# Altium project 12_fit_switch.PrjPCB
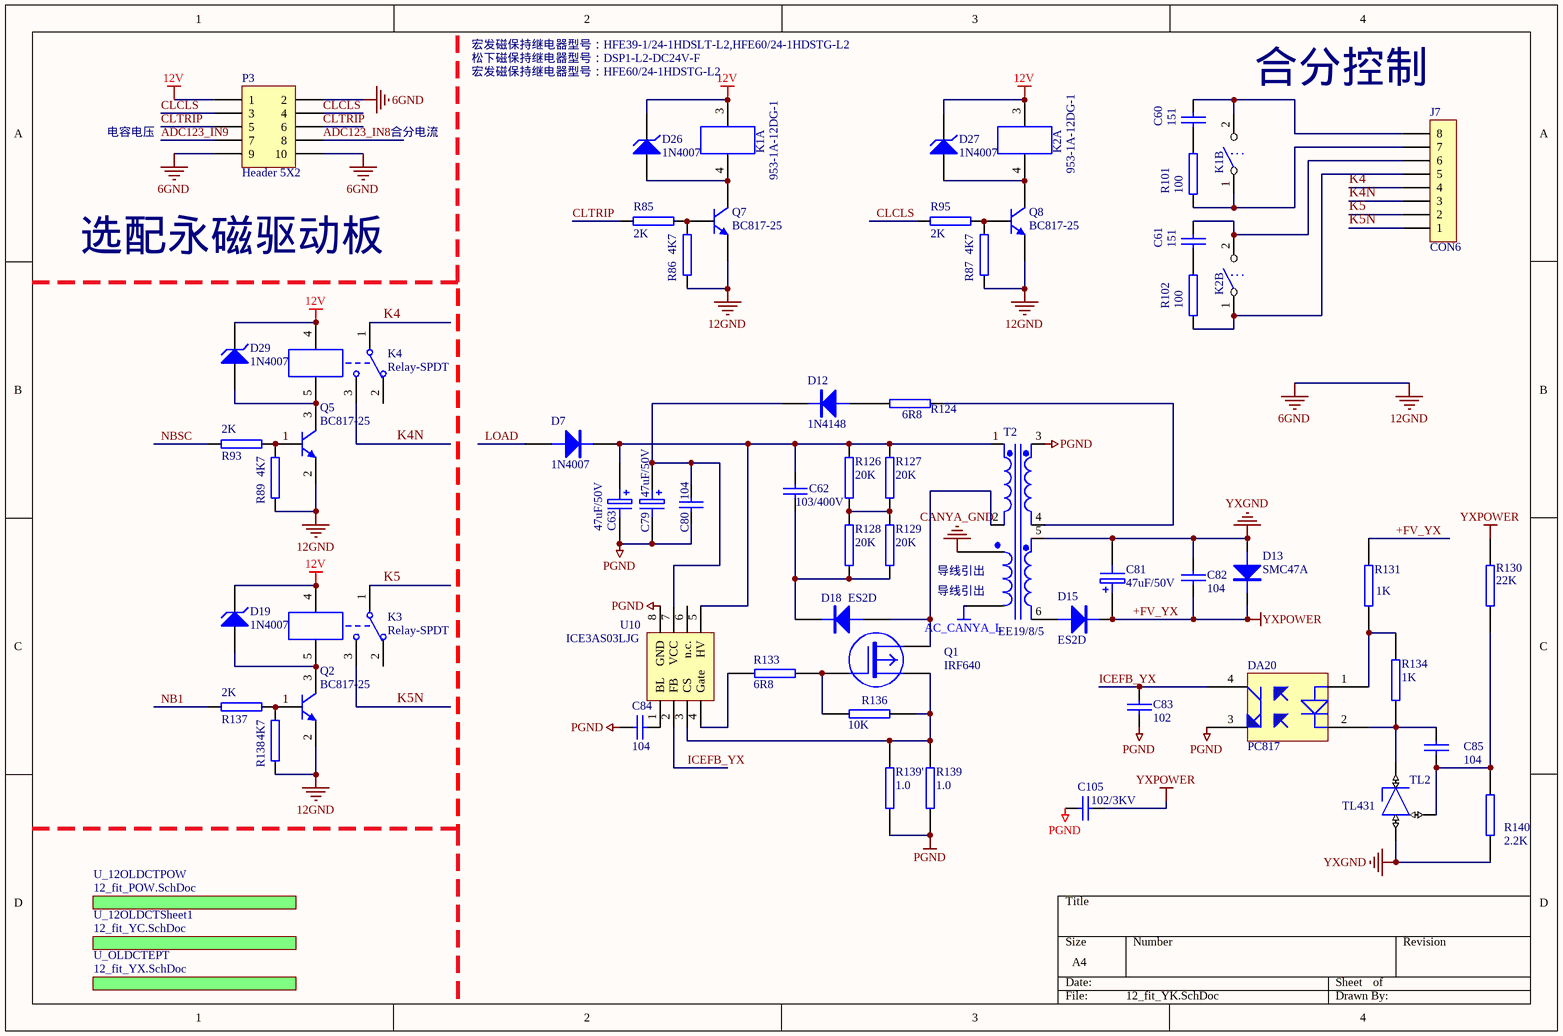
[diagram p0: 12_fit_YK.SchDoc]
4 sheets, 452 parts. Net scope: global (net labels, ports and power ports of the same name join across sheets).
Board file: 12_fit_switch.PcbDoc
Sheets:
  12_fit_YK.SchDoc
    U_12OLDCTPOW = 12_fit_POW.SchDoc
    U_12OLDCTSheet1 = 12_fit_YC.SchDoc
    U_OLDCTEPT = 12_fit_YX.SchDoc

## Sheet 12_fit_YK.SchDoc
size A4; SheetNumber: 3; SheetTotal: 3

### Parts
C60  151  [CAP_HV_10]
C61  151  [CAP_HV_10]
C62  103/400V  [CAP_HV_8]
C63  47uF/50V  [47u/50V]
C79  47uF/50V  [47u/50V]
C80  104  [C1206]
C81  47uF/50V  [47u/50V]
C82  104  [CBB104]
C83  102  [C1206]
C84  104  [C1206]
C85  104  [CBB104]
C105  102/3KV  [CAP_HV_8]
D7  1N4007  [DO-214AA]
D12  1N4148  [SMT_4148]
D13  SMC47A  [DO-214AB]
D15  ES2D  [DO-214AA]
D18  ES2D  [DO-214AA]
D19  1N4007  [DO-214AC]
D26  1N4007  [DO-214AC]
D27  1N4007  [DO-214AC]
D29  1N4007  [DO-214AC]
DA20  PC817  [dip4]
J7  CON6  [XR_POWER5.08_8_弯]
K1  953-1A-12DG-1  [953-1A-12DG-1]  (parts A,B of 2)
K2  953-1A-12DG-1  [953-1A-12DG-1]  (parts A,B of 2)
K3  Relay-SPDT  [JQX-115FA]
K4  Relay-SPDT  [JQX-115FA]
P3  Header 5X2  [HDR2X5]
Q1  IRF640  [TO220-IRF540]
Q2  BC817-25  [SOT-23]
Q5  BC817-25  [SOT-23]
Q7  BC817-25  [SOT-23]
Q8  BC817-25  [SOT-23]
R85  2K  [R1206]
R86  4K7  [R1206]
R87  4K7  [R1206]
R89  4K7  [R1206]
R93  2K  [R1206]
R95  2K  [R1206]
R101  100  [res-l5]
R102  100  [res-l5]
R124  6R8  [R1206]
R126  20K  [R1206]
R127  20K  [R1206]
R128  20K  [R1206]
R129  20K  [R1206]
R130  22K  [R1206]
R131  1K  [R1206]
R133  6R8  [R1206]
R134  1K  [R1206]
R136  10K  [R1206]
R137  2K  [R1206]
R138  4K7  [R1206]
R139  1.0  [R2512]
R139'  1.0  [R2512]
R140  2.2K  [R1206]
T2  EE19/8/5  [EE19/8/5]
TL2  TL431  [SOT-23]
U10  ICE3AS03LJG  [SO8]

### Sub-sheets
U_12OLDCTPOW = 12_fit_POW.SchDoc: no entries
U_12OLDCTSheet1 = 12_fit_YC.SchDoc: no entries
U_OLDCTEPT = 12_fit_YX.SchDoc: no entries

### Nets
12GND: P3.2 P3.9 P3.10 Q2.2(E) Q5.2(E) Q7.2(E) Q8.2(E) R86.1 R87.1 R89.1 R138.1  [also labelled 6GND]
12V: D19.2(K) D26.2(K) D27.2(K) D29.2(K) K1.3 K2.3 K3.4 K4.4 P3.1
+FV_YX: C81.1 C82.1 C105.2 D13.2(K) D15.2(K) R130.2 R131.2  [also labelled YXPOWER]
LOAD: D7.1(A)
PGND: C63.2 C79.2 C80.1 C83.1 C84.1 C105.1 DA20.3 R139.1 R139'.1 T2.3(Sec1+) U10.8(GND)
YXGND: C81.2 C82.2 D13.1(A) R140.1 T2.5(Sec2+) TL2.3(A)
ADC123_IN8: P3.8
ADC123_IN9: P3.7
CLCLS: P3.3 P3.4 R95.1
CLTRIP: P3.5 P3.6 R85.1
ICEFB_YX: C83.2 DA20.4 U10.2(FB)
K4: J7.4 K4.1
K4N: J7.3 K4.3
K5: J7.2 K3.1
K5N: J7.1 K3.3
NB1: R137.1
NBSC: R93.1
NetC60_1: C60.1 R101.1
NetC60_2: C60.2 J7.8 K1.2
NetC61_1: C61.1 J7.6 K2.2
NetC61_2: C61.2 R102.1
NetC62_1: C62.1 D18.2(K) R128.1 R129.1
NetC62_2: C62.2 C63.1 D7.2(K) R126.2 R127.2 T2.1(Pri+) U10.5(HV)
NetC79_1: C79.1 C80.2 D12.2(K) U10.7(VCC)
NetC84_2: C84.2 U10.1(BL)
NetC85_1: C85.1 DA20.2 R134.1 TL2.1(K)
NetC85_2: C85.2 R130.1 R140.2 TL2.2(R)
NetD12_1: D12.1(A) R124.1
NetD15_1: D15.1(A) T2.6(Sec2-)
NetD18_1: D18.1(A) Q1.2(D) T2.2(Pri-)
NetD19_1: D19.1(A) K3.5 Q2.3(C)
NetD26_1: D26.1(A) K1.4 Q7.3(C)
NetD27_1: D27.1(A) K2.4 Q8.3(C)
NetD29_1: D29.1(A) K4.5 Q5.3(C)
NetDA20_1: DA20.1 R131.1 R134.2
NetJ7_5: J7.5 K2.1 R102.2
NetJ7_7: J7.7 K1.1 R101.2
NetQ1_1: Q1.1(G) R133.1 R136.2
NetQ1_3: Q1.3(S) R136.1 R139.2 R139'.2 U10.3(CS)
NetQ2_1: Q2.1(B) R137.2 R138.2
NetQ5_1: Q5.1(B) R89.2 R93.2
NetQ7_1: Q7.1(B) R85.2 R86.2
NetQ8_1: Q8.1(B) R87.2 R95.2
NetR124_2: R124.2 T2.4(Sec1-)
NetR126_1: R126.1 R127.1 R128.2 R129.2
NetR133_2: R133.2 U10.4(Gate)

Not connected (* = marked no-connect by the designer): K3 2; K4 2; U10 6(n.c.)

### Notes on the sheet
- 宏发磁保持继电器型号：HFE39-1/24-1HDSLT-L2,HFE60/24-1HDSTG-L2
- 松下磁保持继电器型号：DSP1-L2-DC24V-F
- 宏发磁保持继电器型号：HFE60/24-1HDSTG-L2
- 合分控制
- 电容电压
- 合分电流
- 选配永磁驱动板
- 导线引出
- Labels drawn without touching a wire or pin: AC_CANYA_L, CANYA_GND

### Library data of the parts
C60-C62 C83 = CAP
C63 C79 C81 = ELECTRO1: Electrolytic Capacitor
C80 C82 C84 C85 C105 = CAP: Capacitor
D7 D12 D13 D15 D18 = DIODE
D19 D26 D27 D29 = D Zener: Zener Diode; Published: 8-Jun-2000; LatestRevisionDate: 17-Jul-2002; LatestRevisionNote: Re-released for DXP Platform.; PackageReference: DIODE-0.7; Publisher: Altium Limited; PackageDescription: Diode, Thru-Hole; 2 Leads; 0.7 in Pin Spacing
DA20 = TLP521-1
J7 = CON8: Connector
K1 K2 = RLY-STY1: RELAY
K3 K4 = Relay-SPDT: Single-Pole Dual-Throw Relay; Published: 24-Mar-1999; LatestRevisionDate: 17-Jul-2002; LatestRevisionNote: Re-released for DXP Platform.; PackageReference: MODULE5B; Publisher: Altium Limited
P3 = Header 5X2: Header, 5-Pin, Dual row; LatestRevisionDate: 17-Jul-2002; LatestRevisionNote: Re-released for DXP Platform.; Publisher: Altium Limited
Q1 = MOSFET-P1
Q2 Q5 Q7 Q8 = SOT-23 2SC3356-T1B-A    S/YS档: NPN; ComponentLink1Description: 供应商链接; ComponentLink1URL: http://www.szlcsc.com/product/details_10189.html; Package: SOT-23; Supplier: LC; SuppliersPartNumber: C9659
R85-R87 R89 R93 R95 R101 R102 R124 R126-R131 R133 R134 R136-R139 R139' R140 = RES2
T2 = Trans3 Ideal: Three-winding Transformer (Ideal); Published: 25-Jan-2001; LatestRevisionDate: 17-Jul-2002; LatestRevisionNote: Re-released for DXP Platform.; PackageReference: TRF_6; Publisher: Altium Limited; PackageDescription: Transformer; 6 Leads

## Sheet 12_fit_POW.SchDoc
size B; SheetNumber: 2; SheetTotal: 3
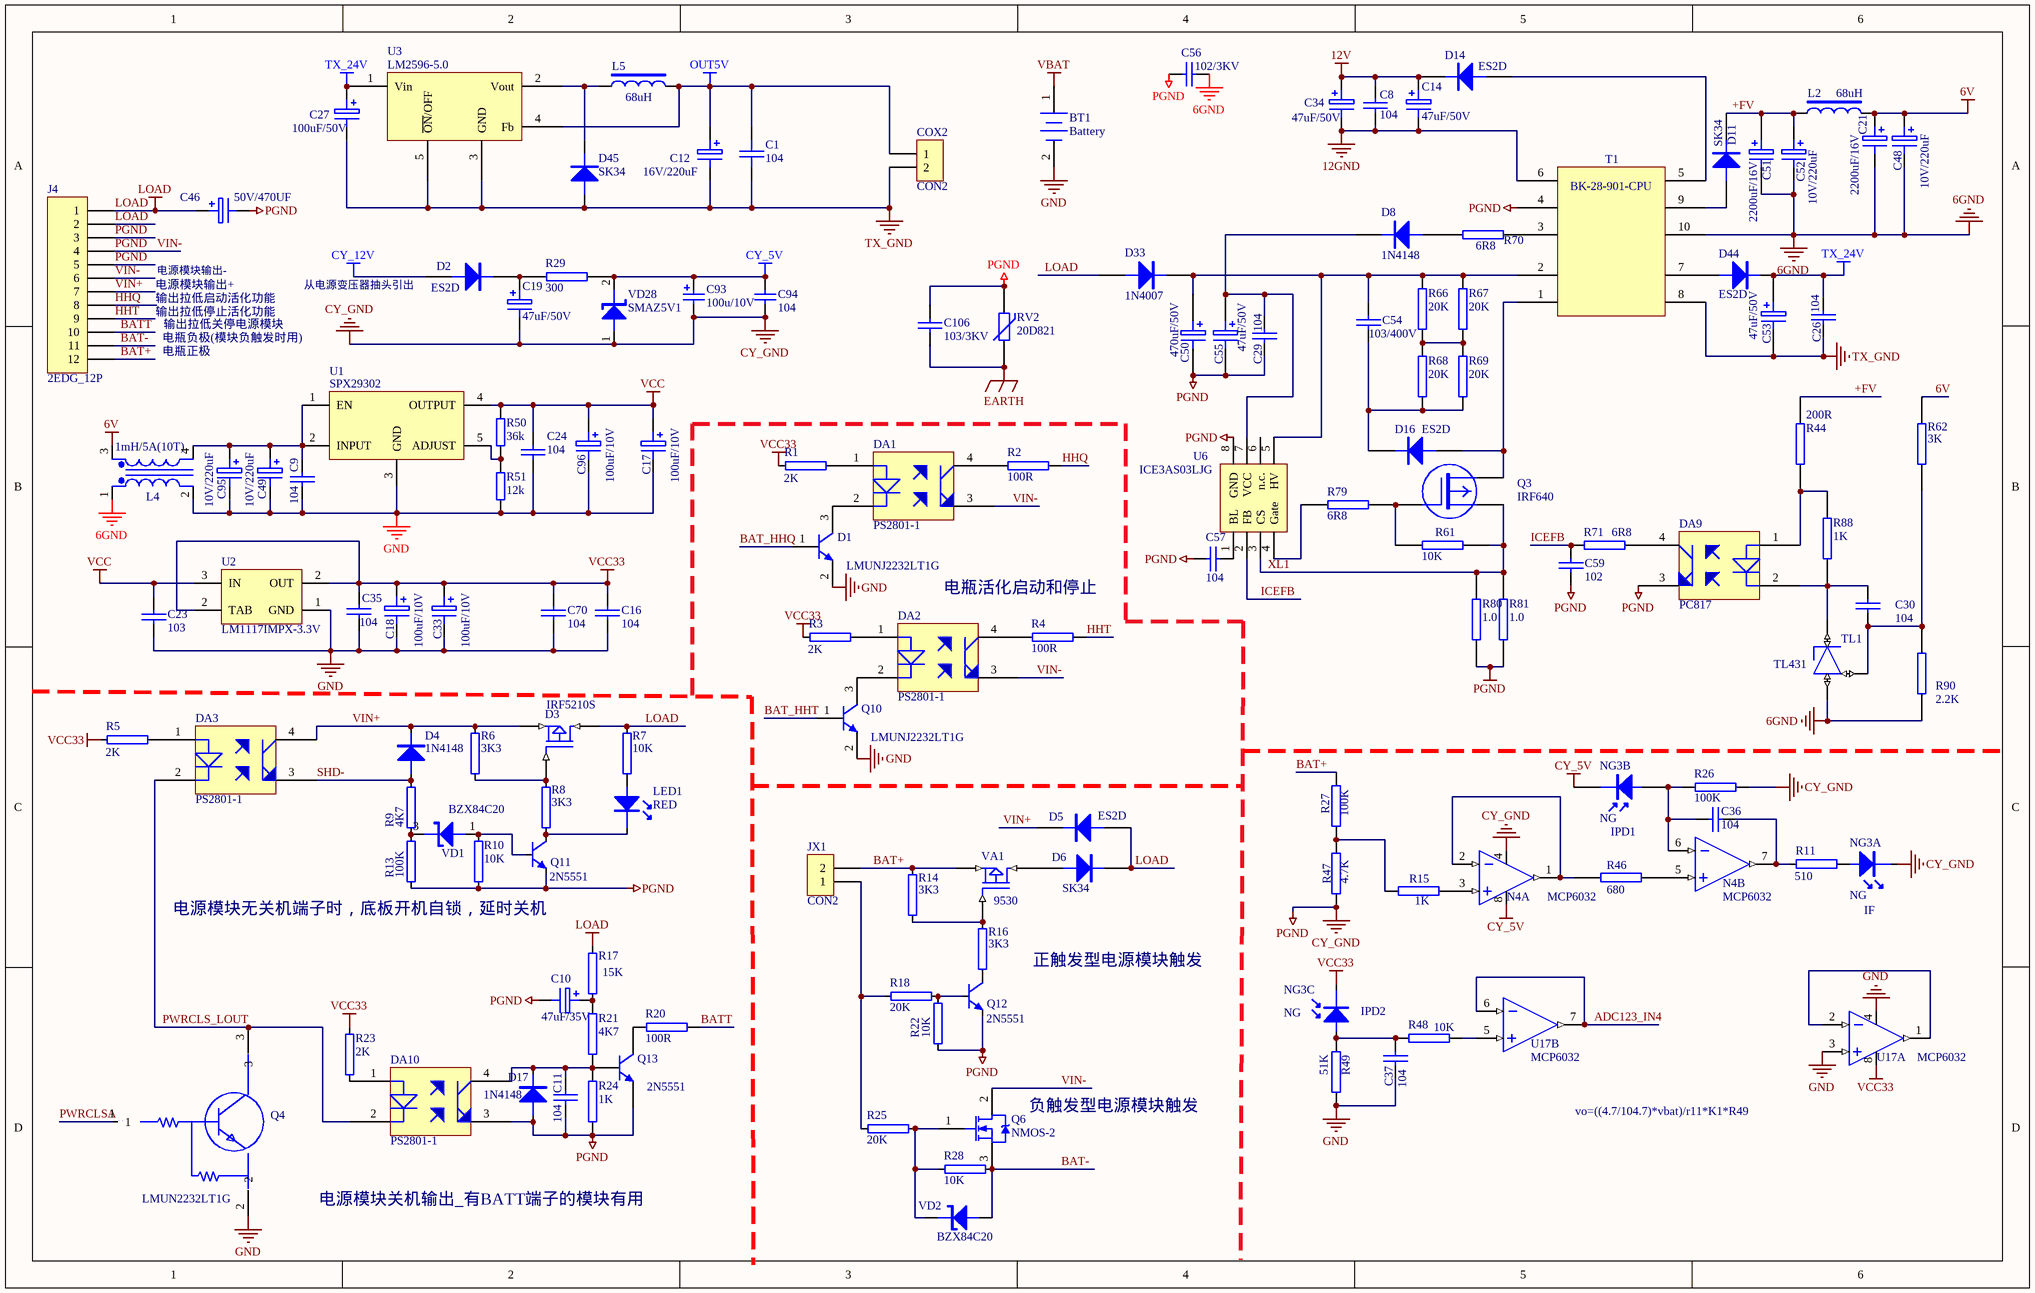
[diagram p1: 12_fit_POW.SchDoc]

### Parts
BT1  Battery  [3.3VBAT]
C1  104  [C1206]
C8  104  [CBB104]
C9  104  [CBB104]
C10  47uF/35V  [47u/50V]
C11  104  [C1206]
C12  16V/220uF  [钽电解C型EC6032]
C14  47uF/50V  [47u/50V]
C16  104  [C1206]
C17  100uF/10V  [钽电容B型3528]
C18  100uF/10V  [钽电容B型3528]
C19  47uF/50V  [47u/50V]
C21  2200uF/16V  [470u/63V]
C23  103  [C1206]
C24  104  [C1206]
C26  104  [C1206]
C27  100uF/50V  [SL-H贴片铝电解8mm]
C29  104  [C1206]
C30  104  [CBB104]
C33  100uF/10V  [钽电容B型3528]
C34  47uF/50V  [47u/50V]
C35  104  [C1206]
C36  104  [C1206]
C37  104  [C1206]
C46  50V/470UF  [470u/63V]
C48  10V/220uF  [钽电解C型EC6032]
C49  10V/220uF  [钽电解C型EC6032]
C50  470uF/50V  [470u/63V]
C51  2200uF/16V  [470u/63V]
C52  10V/220uF  [钽电解C型EC6032]
C53  47uF/50V  [47u/50V]
C54  103/400V  [CAP_HV_8]
C55  47uF/50V  [47u/50V]
C56  102/3KV  [CAP_HV_8]
C57  104  [C1206]
C59  102  [C1206]
C70  104  [C1206]
C93  100u/10V  [钽电容B型3528]
C94  104  [C1206]
C95  10V/220uF  [钽电解C型EC6032]
C96  100uF/10V  [钽电容B型3528]
C106  103/3KV  [CAP_HV_8]
COX2  CON2  [5569_2P_4.2直]
D1  LMUNJ2232LT1G  [SOT-23]
D2  ES2D  [DO-214AA]
D3  IRF5210S  [TO-220-SRQ]
D4  1N4148  [SMT_4148]
D5  ES2D  [DO-214AA]
D6  SK34  [DO-214AA]
D8  1N4148  [SMT_4148]
D11  SK34  [DO-214AA]
D14  ES2D  [DO-214AA]
D16  ES2D  [DO-214AA]
D17  1N4148  [SMT_4148]
D33  1N4007  [DO-214AA]
D44  ES2D  [DO-214AA]
D45  SK34  [DO-214AA]
DA1  PS2801-1  [SO-4]
DA2  PS2801-1  [SO-4]
DA3  PS2801-1  [SO-4]
DA9  PC817  [dip4]
DA10  PS2801-1  [SO-4]
J4  2EDG_12P  [XR_POWER5.08_12_弯]
JX1  CON2  [5569_2P_4.2直]
L2  68uH  [L680-TP]
L4  1mH/5A(10T)  [EMI_22_3mH]
L5  68uH  [L680-TP]
LED1  RED  [LED1206]
N4  MCP6032  [SO8]  (parts A,B of 2)
NG3  NG  [DIP8W]  (parts A,B,C of 3)
Q3  IRF640  [TO220-IRF540]
Q4  LMUN2232LT1G  [SOT-23]
Q6  NMOS-2  [TO220-IRF540]
Q10  LMUNJ2232LT1G  [SOT-23]
Q11  2N5551  [SOT-23]
Q12  2N5551  [SOT-23]
Q13  2N5551  [SOT-23]
R1  2K  [R1206]
R2  100R  [R1206]
R3  2K  [R1206]
R4  100R  [R1206]
R5  2K  [R1206]
R6  3K3  [R1206]
R7  10K  [R1206]
R8  3K3  [R1206]
R9  4K7  [R1206]
R10  10K  [R1206]
R11  510  [R1206]
R13  100K  [R1206]
R14  3K3  [R1206]
R15  1K  [R1206]
R16  3K3  [R1206]
R17  15K  [R1206]
R18  20K  [R1206]
R20  100R  [R1206]
R21  4K7  [R1206]
R22  10K  [R1206]
R23  2K  [R1206]
R24  1K  [R1206]
R25  20K  [R1206]
R26  100K  [R1206]
R27  100K  [R1206]
R28  10K  [R1206]
R29  300  [R2512]
R44  200R  [R1206]
R46  680  [R1206]
R47  4.7K  [R1206]
R48  10K  [R1206]
R49  51K  [R1206]
R50  36k  [R1206]
R51  12k  [R1206]
R61  10K  [R1206]
R62  3K  [R1206]
R66  20K  [R1206]
R67  20K  [R1206]
R68  20K  [R1206]
R69  20K  [R1206]
R70  6R8  [R1206]
R71  6R8  [R1206]
R79  6R8  [R1206]
R80  1.0  [R2512]
R81  1.0  [R2512]
R88  1K  [R1206]
R90  2.2K  [R1206]
RV2  20D821  [20D301]
T1  BK-28-901-CPU  [DC24S15]
TL1  TL431  [SOT-23]
U1  SPX29302  [TO-263-5]
U2  LM1117IMPX-3.3V  [SOT223]
U3  LM2596-5.0  [TO-263-5]
U6  ICE3AS03LJG  [SO8]
U17  MCP6032  [SO8]  (parts A,B of 2)
VA1  9530  [TO220-IRF540]
VD1  BZX84C20  [SOT-23]
VD2  BZX84C20  [SOT-23]
VD28  SMAZ5V1  [DO-214AC]

### Nets
6V: C21.1 C48.1 L2.2 L4.3(Sec+) R62.2
12GND: C8.2 C14.2 C21.2 C34.2 C48.2 C51.2 C52.2 C56.2 L4.1(Pri+) R90.1 T1.6 T1.10 TL1.3(A)  [also labelled 6GND]
12V: C8.1 C14.1 C34.1 D14.2(K)
CY_5V: C93.1 C94.2 N4.8 NG3.3(K) R29.1 VD28.2
CY_12V: D2.1(A)
EARTH: C106.1 RV2.1
GND: BT1.2(-) C9.2 C16.1 C17.2 C18.2 C23.2 C24.1 C33.2 C35.2 C37.2 C49.2 C70.1 C95.2 C96.2 D1.2(E) L4.2(Pri-) Q4.2 Q10.2(E) R49.1 R51.1 U1.3(GND) U2.1(GND) U17.3 U17.4
LOAD: C46.1 D3.2(D) D5.1(A) D6.2(K) D33.1(A) J4.1 J4.2 R7.2 R17.2
OUT5V: C1.2 C12.1 COX2.1 L5.2 U3.4(Fb)
PGND: C10.2 C11.1 C19.2 C29.1 C46.2 C50.2 C55.2 C56.1 C57.1 C59.1 C93.2 C94.1 C106.2 D17.1(A) DA1.3 DA2.3 DA9.3 DA10.3 J4.3 J4.4 J4.5 J4.6 N4.4 NG3.1(K) Q6.2(D) Q11.2(E) Q12.2(E) Q13.2(E) R10.2 R13.2 R22.1 R24.1 R26.1 R47.1 R80.1 R81.1 RV2.2 T1.4 U6.8(GND) VD28.1  [also labelled CY_GND, VIN-]
TX_24V: C26.1 C27.1 C53.1 D44.2(K) U3.1(Vin)
TX_GND: C1.1 C12.2 C26.2 C27.2 C53.2 COX2.2 D45.1 T1.8 U3.3(GND) U3.5(~{ON}/OFF)
VBAT: BT1.1(+)
VCC: C17.1 C23.1 C24.2 C96.1 R50.1 U1.4(OUTPUT) U2.3(IN)
VCC33: C16.2 C18.1 C33.1 C35.1 C70.2 NG3.6(K) R1.2 R3.2 R5.2 R23.1 U2.2(OUT) U17.8
+FV: C51.1 C52.1 D11.2(K) L2.1 R44.2
ADC123_IN4: U17.6 U17.7
BAT+: J4.12 JX1.2 R14.2 R27.2 VA1.3(S)
BAT-: J4.11 Q6.3(S) R28.1 VD2.1
BAT_HHQ: D1.1(B)
BAT_HHT: Q10.1(B)  [project net ADC123_IN3]
BATT: J4.10 R20.1
HHQ: J4.8 R2.1
HHT: J4.9 R4.1
ICEFB: C59.2 R71.1 U6.2(FB)
PWRCLS_LOUT: DA3.2 DA10.2 Q4.3
PWRCLSA: Q4.1
SHD-: D4.1(A) DA3.3 R9.2
VIN+: D3.3(S) D4.2(K) D5.2(K) DA3.4 J4.7 R6.2
XL1: Q3.3(S) R61.1 R80.2 R81.2 U6.3(CS)
NetC9_1: C9.1 C49.1 C95.1 L4.4(Sec-) U1.1(EN) U1.2(INPUT)
NetC10_1: C10.1 R17.1 R21.2
NetC11_2: C11.2 D17.2(K) DA10.4 Q13.1(B) R21.1 R24.2
NetC19_1: C19.1 D2.2(K) R29.2
NetC29_2: C29.2 C55.1 D8.2(K) U6.7(VCC)
NetC30_1: C30.1 DA9.2 R88.1 TL1.1(K)
NetC30_2: C30.2 R62.1 R90.2 TL1.2(R)
NetC36_1: C36.1 N4.6 NG3.4(A) R26.2
NetC36_2: C36.2 N4.7 R11.2
NetC37_1: C37.1 NG3.5(A) R48.2 R49.2
NetC50_1: C50.1 C54.2 D33.2(K) R66.2 R67.2 T1.2 U6.5(HV)
NetC54_1: C54.1 D16.2(K) R68.1 R69.1
NetC57_2: C57.2 U6.1(BL)
NetD1_3: D1.3(C) DA1.2
NetD3_1: D3.1(G) R6.1 R8.2
NetD6_1: D6.1(A) VA1.2(D)
NetD8_1: D8.1(A) R70.1
NetD11_1: D11.1(A) T1.9
NetD14_1: D14.1(A) T1.5
NetD16_1: D16.1(A) Q3.2(D) T1.1
NetD44_1: D44.1(A) T1.7
NetD45_2: D45.2 L5.1 U3.2(Vout)
NetDA1_1: DA1.1 R1.1
NetDA1_4: DA1.4 R2.2
NetDA2_1: DA2.1 R3.1
NetDA2_2: DA2.2 Q10.3(C)
NetDA2_4: DA2.4 R4.2
NetDA3_1: DA3.1 R5.1
NetDA9_1: DA9.1 R44.1 R88.2
NetDA9_4: DA9.4 R71.2
NetDA10_1: DA10.1 R23.2
NetJX1_1: JX1.1 R18.2 R25.2
NetLED1_A: LED1.A R7.1
NetLED1_K: LED1.K Q11.3(C) R8.1
NetN4_1: N4.1 N4.2 R46.1
NetN4_3: N4.3 R15.1
NetN4_5: N4.5 R46.2
NetNG3_2: NG3.2(A) R11.1
NetQ3_1: Q3.1(G) R61.2 R79.1
NetQ6_1: Q6.1(G) R25.1 R28.2 VD2.3
NetQ11_1: Q11.1(B) R10.1 VD1.1
NetQ12_1: Q12.1(B) R18.1 R22.2
NetQ12_3: Q12.3(C) R16.1
NetQ13_3: Q13.3(C) R20.2
NetR9_1: R9.1 R13.1 VD1.3
NetR14_1: R14.1 R16.2 VA1.1(G)
NetR15_2: R15.2 R27.1 R47.2
NetR48_1: R48.1 U17.5
NetR50_2: R50.2 R51.2 U1.5(ADJUST)
NetR66_1: R66.1 R67.1 R68.2 R69.2
NetR70_2: R70.2 T1.3
NetR79_2: R79.2 U6.4(Gate)
NetU17_1: U17.1 U17.2

Not connected (* = marked no-connect by the designer): U6 6(n.c.)

### Notes on the sheet
- 电源模块输出+
- 输出拉低启动活化功能
- 电源模块输出-
- 从电源变压器抽头引出
- 输出拉低停止活化功能
- 电瓶正极
- 电瓶负极(模块负触发时用)
- 输出拉低关停电源模块
- 电瓶活化启动和停止
- IPD1
- 电源模块无关机端子时，底板开机自锁，延时关机
- 正触发型电源模块触发
- IF
- IPD2
- (near Q6) 负触发型电源模块触发
- vo=((4.7/104.7)*vbat)/r11*K1*R49
- 电源模块关机输出_有BATT端子的模块有用

### Library data of the parts
BT1 = Battery: Multicell Battery; Published: 24-Mar-1999; LatestRevisionDate: 17-Jul-2002; LatestRevisionNote: Re-released for DXP Platform.; PackageReference: BAT-2; Publisher: Altium Limited; PackageDescription: Battery; 2 Leads
C1 C8 C9 C11 C16 C23 C24 C26 C29 C30 C36 C37 C56 C57 C70 C106 = CAP: Capacitor
C10 C14 C19 C34 C46 C50 C51 C53 C55 = ELECTRO1: Electrolytic Capacitor
C12 C48 C49 C52 C95 = ELECTRO: Electrolytic Capacitor
C17 C18 C21 C27 C33 C96 = ELECTRO1
C35 C54 C59 = CAP
C93 = Cap Pol2: Polarized Capacitor (Axial); Value: 100pF; Published: 8-Jun-2000; LatestRevisionDate: 17-Jul-2002; LatestRevisionNote: Re-released for DXP Platform.; PackageReference: POLAR0.8; Publisher: Altium Limited; PackageDescription: Polarized Capacitor; 2 Leads
C94 = Cap: Capacitor; Value: 100pF; Published: 8-Jun-2000; LatestRevisionDate: 17-Jul-2002; LatestRevisionNote: Re-released for DXP Platform.; PackageReference: RAD-0.3; Publisher: Altium Limited; PackageDescription: Radial Cap, Thru-Hole; 2 Leads; 0.3 in Pin Spacing
COX2 JX1 = CON2: Connector
D1 Q10-Q13 = SOT-23 2SC3356-T1B-A    S/YS档: 三极管; ComponentLink1Description: 供应商链接; ComponentLink1URL: http://www.szlcsc.com/product/details_10189.html; Package: SOT-23; Supplier: LC; SuppliersPartNumber: C9659
D2 D4-D6 D8 D11 D14 D16 D17 D33 D44 = DIODE
D3 VA1 = MOSFET P
D45 = DIDOE: Diode
DA1-DA3 DA9 DA10 = TLP521-1
J4 = Header 12: Header, 12-Pin; LatestRevisionDate: 17-Jul-2002; LatestRevisionNote: Re-released for DXP Platform.; Publisher: Altium Limited
L2 L5 = INDUCTOR2
L4 = Trans Cupl: Transformer (Coupled Inductor Model); Published: 8-Jun-2000; LatestRevisionDate: 17-Jul-2002; LatestRevisionNote: Re-released for DXP Platform.; PackageReference: TRF_4; Publisher: Altium Limited; PackageDescription: Transformer; 4 Leads
LED1 = LED
N4 U17 = TL082
Q3 = MOSFET-P1
Q4 = T-NPN-LMUN2232LT1G-SOT23: Vceo=50V,Vcbo=50V,Ic=100mA,Hfe=15@Ic=5mA,R1=R2=4.7k; MFR: ROHM; Geometry.Height: 1.2mm; SN: 41100010; TYPE: NPN数字三极管; Value: DNI-LMUN2232LT1G; PCB DECAL: SOT23; MPN: LMUN2232LT1G; PCB Footprint: SOT-23
Q6 = NMOS-2: N-Channel Power MOSFET; Note: Pin 2 is electrically connected to pin 4.; Published: 8-Jun-2000; LatestRevisionDate: 17-Jul-2002; LatestRevisionNote: Re-released for DXP Platform.; DatasheetVersion: PD-9.814; PackageVersion: Feb-1997; PackageReference: TO-220AB; Publisher: Altium Limited; PackageDescription: TO, Thru-Hole, Vertical, Heatsink Mounted; 3 In-Line Leads; Pitch 2.54 mm; ComponentLink1Description: Manufacturer Link; ComponentLink1URL: http://www.irf.com/
R1-R11 R13-R18 R20-R29 R44 R46-R49 R61 R62 R66-R71 R79-R81 R88 R90 = RES2
R50 R51 = RES
RV2 = VARISTOR
T1 = DC24S15
U2 = LM1117IMPX-3.3: 800mA Low-Dropout Linear Regulator, 4-pin SOT-223; Manufacturer: National Semiconductor; PackageTopMarking: XYTT*N05B; PowerWise: N; CompType: LDO IC; Published: 1-Mar-2010; DatasheetVersion: Apr-2006; PackageVersion: revB, Apr-2003; PackageReference: MP04A; Publisher: Altium Limited; PackageDescription: Molded SOT-223, 6.50 x 3.56 x 1.6mm Body, 4 Lead, 2.3mm Pitch; PartNumber: LM1117IMPX-3.3; RoHS: N; PinCount: 4; Code_JEDEC: TO-261-AA; Code_IPC: SOT223-4; ComponentLink1Description: LM1117 Datasheet; ComponentLink1URL: http://www.national.com/ds/LM/LM1117.pdf; ComponentLink2Description: LM1117 Web Page; ComponentLink2URL: http://www.national.com/pf/LM/LM1117.html; ComponentLink3Description: MP04A Package Page; ComponentLink3URL: http://www.national.com/packaging/folders/mp04a.html
U3 = LM2596
VD1 VD2 VD28 = ZENER2

## Sheet 12_fit_YC.SchDoc
size A2
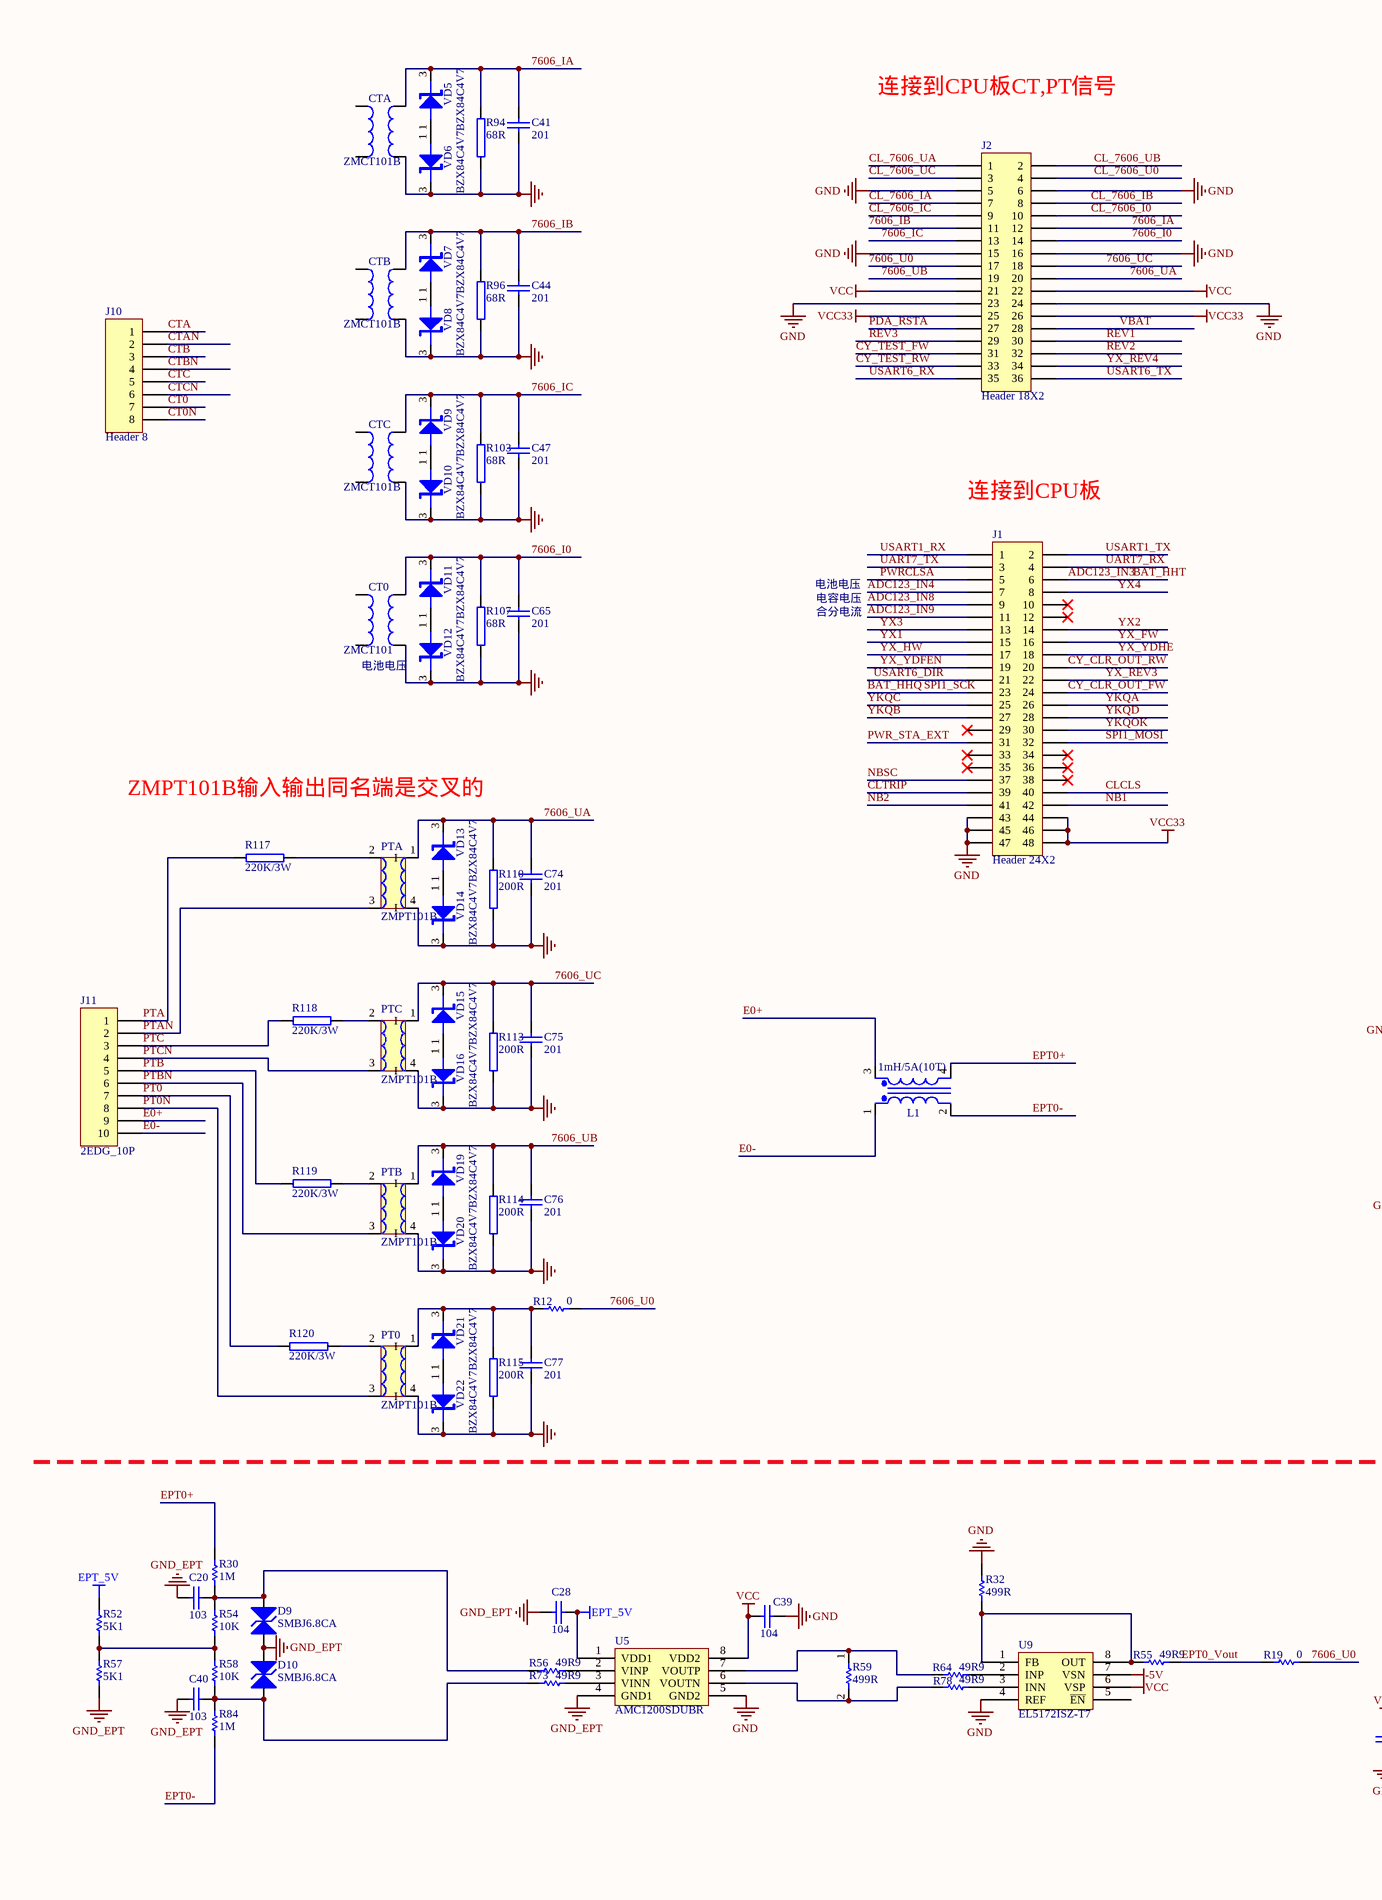
[diagram p2: 12_fit_YC.SchDoc, left]
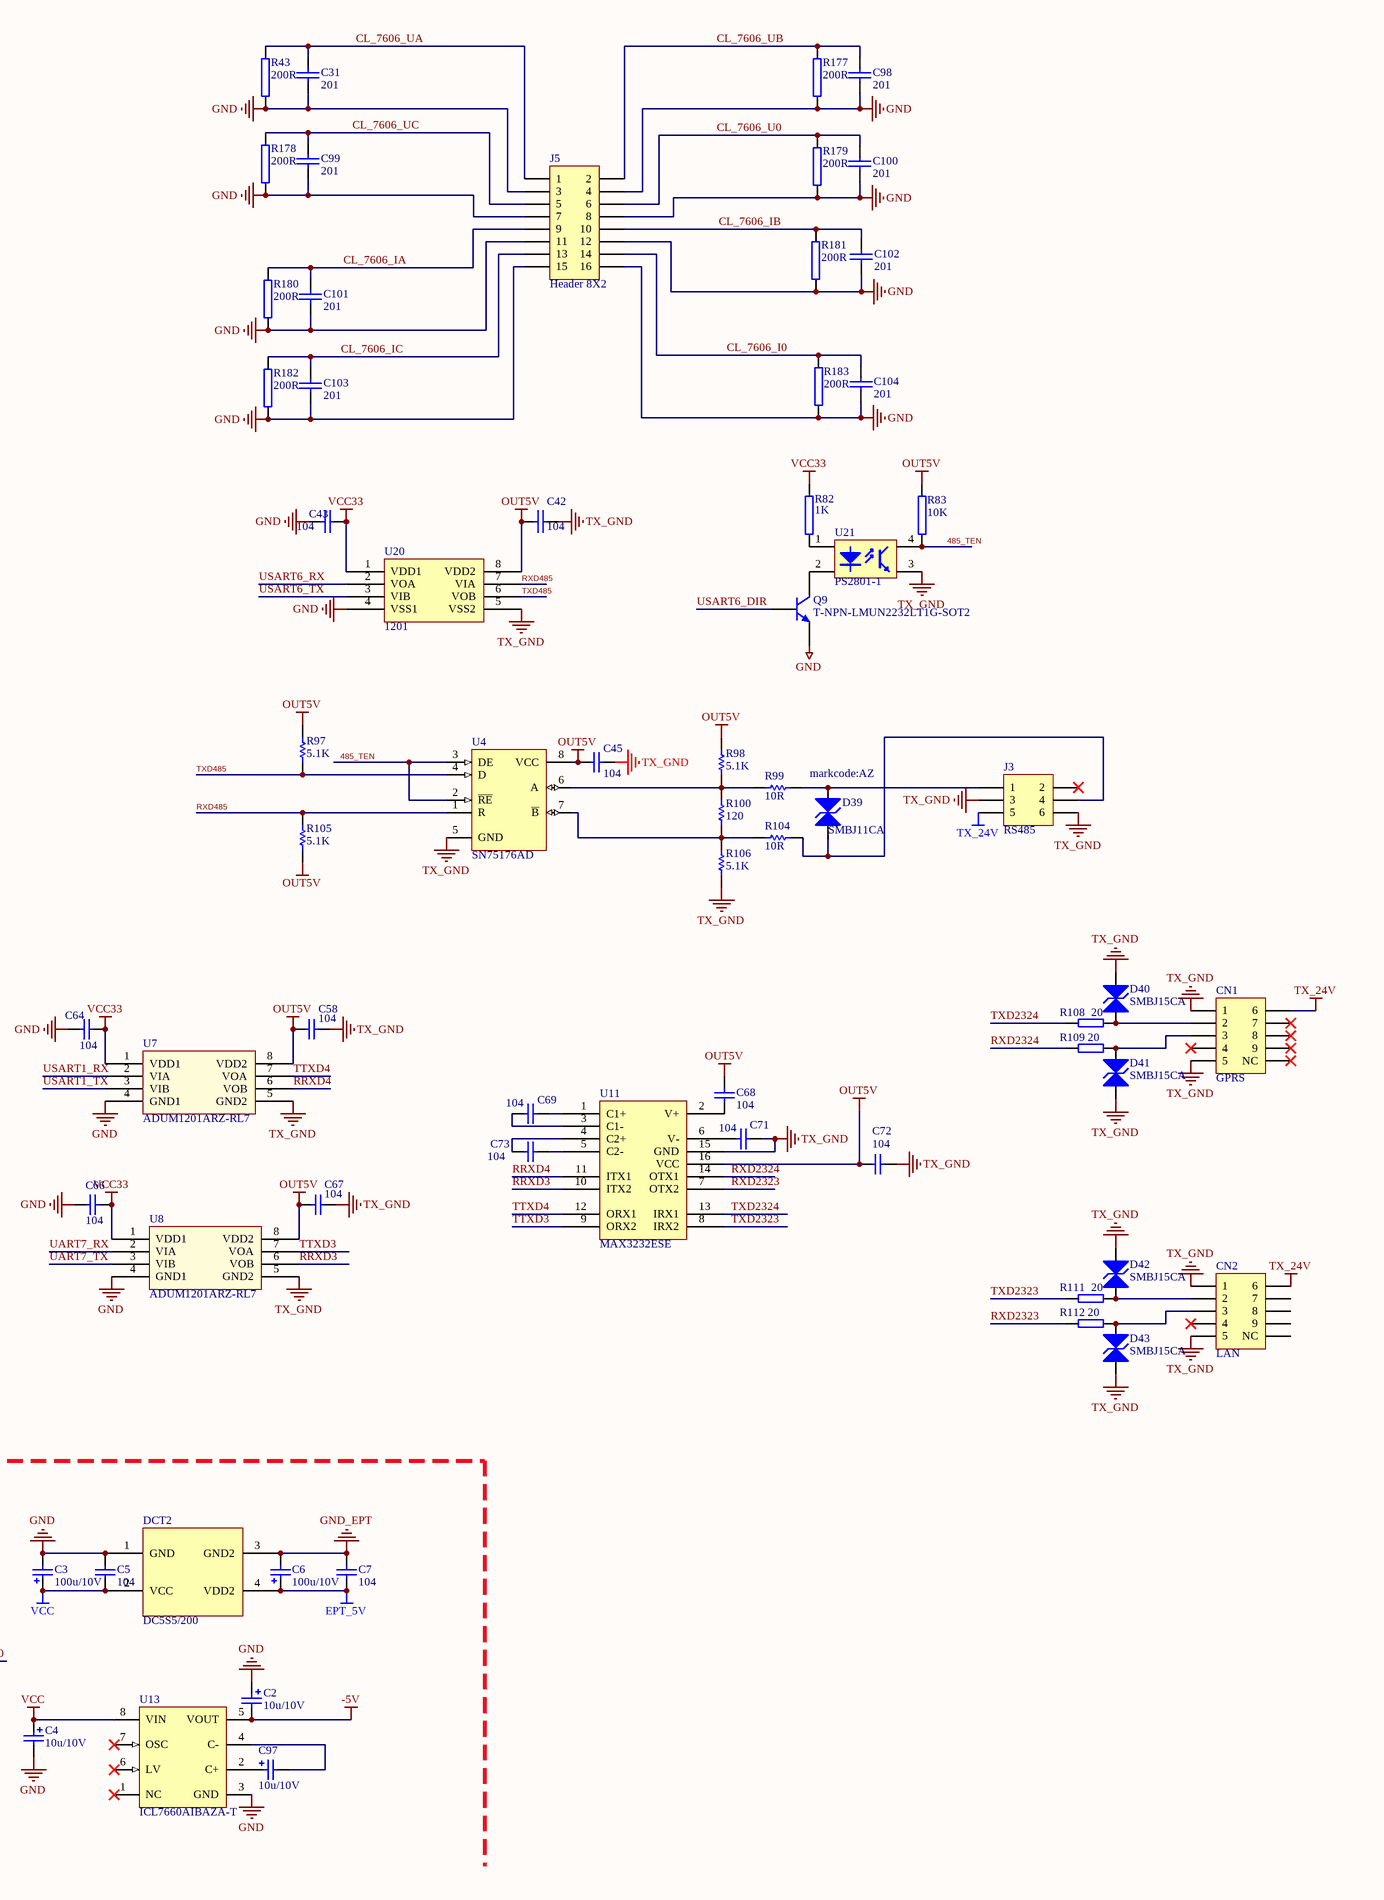
[diagram p3: 12_fit_YC.SchDoc, right]

### Parts
C2  10u/10V  [钽电容B型3528]
C3  100u/10V  [钽电容B型3528]
C4  10u/10V  [钽电容B型3528]
C5  104  [C1206]
C6  100u/10V  [钽电容B型3528]
C7  104  [C1206]
C20  103  [C1206]
C28  104  [C1206]
C31  201  [C1206]
C39  104  [C1206]
C40  103  [C1206]
C41  201  [C1206]
C42  104  [C1206]
C43  104  [C1206]
C44  201  [C1206]
C45  104  [C1206]
C47  201  [C1206]
C58  104  [C1206]
C64  104  [C1206]
C65  201  [C1206]
C66  104  [C1206]
C67  104  [C1206]
C68  104  [C1206]
C69  104  [C1206]
C71  104  [C1206]
C72  104  [C1206]
C73  104  [C1206]
C74  201  [C1206]
C75  201  [C1206]
C76  201  [C1206]
C77  201  [C1206]
C97  10u/10V  [钽电容B型3528]
C98  201  [C1206]
C99  201  [C1206]
C100  201  [C1206]
C101  201  [C1206]
C102  201  [C1206]
C103  201  [C1206]
C104  201  [C1206]
CN1  GPRS  [IDC10]
CN2  LAN  [IDC10]
CT0  ZMCT101  [ZMCT101B_OUTLINE]
CTA  ZMCT101B  [ZMCT101B_OUTLINE]
CTB  ZMCT101B  [ZMCT101B_OUTLINE]
CTC  ZMCT101B  [ZMCT101B_OUTLINE]
D9  SMBJ6.8CA  [SMT-5822]
D10  SMBJ6.8CA  [SMT-5822]
D39  SMBJ11CA  [SMT-5822]
D40  SMBJ15CA  [SMT-5822]
D41  SMBJ15CA  [SMT-5822]
D42  SMBJ15CA  [SMT-5822]
D43  SMBJ15CA  [SMT-5822]
DCT2  DC5S5/200  [IB-LS]
J1  Header 24X2  [HDR2X24]
J2  Header 18X2  [HDR2X18]
J3  RS485  [5569_3X2_4.2直]
J5  Header 8X2  [双排针母座2.54_2*8]
J10  Header 8  [XR_POWER9.5_8]
J11  2EDG_10P  [XR_POWER5.08_10_弯]
L1  1mH/5A(10T)  [EMI_22_3mH]
PT0  ZMPT101B  [ZMPT107]
PTA  ZMPT101B  [PT_SPT204A_2/2mA]
PTB  ZMPT101B  [ZMPT107]
PTC  ZMPT101B  [PT_SPT204A_2/2mA]
Q9  T-NPN-LMUN2232LT1G-SOT2  [SOT-23]
R12  0  [R1206]
R19  0  [R1206]
R30  1M  [R1206]
R32  499R  [R1206]
R43  200R  [R1206]
R52  5K1  [R1206]
R54  10K  [R1206]
R55  49R9  [R1206]
R56  49R9  [R1206]
R57  5K1  [R1206]
R58  10K  [R1206]
R59  499R  [R1206]
R64  49R9  [R1206]
R73  49R9  [R1206]
R78  49R9  [R1206]
R82  1K  [R1206]
R83  10K  [R1206]
R84  1M  [R1206]
R94  68R  [R1206]
R96  68R  [R1206]
R97  5.1K  [R1206]
R98  5.1K  [R1206]
R99  10R  [R1206]
R100  120  [R1206]
R103  68R  [R1206]
R104  10R  [R1206]
R105  5.1K  [R1206]
R106  5.1K  [R1206]
R107  68R  [R1206]
R108  20  [R1206]
R109  20  [R1206]
R110  200R  [R1206]
R111  20  [R1206]
R112  20  [R1206]
R113  200R  [R1206]
R114  200R  [R1206]
R115  200R  [R1206]
R117  220K/3W  [res-l5]
R118  220K/3W  [res-l5]
R119  220K/3W  [res-l5]
R120  220K/3W  [res-l5]
R177  200R  [R1206]
R178  200R  [R1206]
R179  200R  [R1206]
R180  200R  [R1206]
R181  200R  [R1206]
R182  200R  [R1206]
R183  200R  [R1206]
U4  SN75176AD  [SO8]
U5  AMC1200SDUBR  [SOP8(贴片DIP8)]
U7  ADUM1201ARZ-RL7  [SO8]
U8  ADUM1201ARZ-RL7  [SO8]
U9  EL5172ISZ-T7  [SO8]
U11  MAX3232ESE  [SOP16]
U13  ICL7660AIBAZA-T  [SO8]
U20  1201  [SO8]
U21  PS2801-1  [SO-4]
VD5  BZX84C4V7  [SOT-23]
VD6  BZX84C4V7  [SOT-23]
VD7  BZX84C4V7  [SOT-23]
VD8  BZX84C4V7  [SOT-23]
VD9  BZX84C4V7  [SOT-23]
VD10  BZX84C4V7  [SOT-23]
VD11  BZX84C4V7  [SOT-23]
VD12  BZX84C4V7  [SOT-23]
VD13  BZX84C4V7  [SOT-23]
VD14  BZX84C4V7  [SOT-23]
VD15  BZX84C4V7  [SOT-23]
VD16  BZX84C4V7  [SOT-23]
VD19  BZX84C4V7  [SOT-23]
VD20  BZX84C4V7  [SOT-23]
VD21  BZX84C4V7  [SOT-23]
VD22  BZX84C4V7  [SOT-23]

### Nets
-5V: C2.2 U9.7(VSN) U13.5(VOUT)
EPT_5V: C6.1 C7.2 C28.1 DCT2.4(VDD2) R52.1 U5.1(VDD1)
GND: C2.1 C3.2 C4.2 C5.1 C31.2 C39.1 C41.2 C43.1 C44.2 C47.2 C64.1 C65.2 C66.1 C74.2 C75.2 C76.2 C77.2 C98.2 C99.2 C100.2 C101.2 C102.2 C103.2 C104.2 CT0.2 CTA.2 CTB.2 CTC.2 DCT2.1(GND) J1.43 J1.45 J1.47 J2.5 J2.6 J2.15 J2.16 J2.23 J2.24 J5.3 J5.4 J5.7 J5.8 J5.11 J5.12 J5.15 J5.16 PT0.4(I) PTA.4(I) PTB.4(I) PTC.4(I) Q9.2(E) R32.1 R43.1 R94.1 R96.1 R103.1 R107.1 R110.1 R113.1 R114.1 R115.1 R177.1 R178.1 R179.1 R180.1 R181.1 R182.1 R183.1 U5.5(GND2) U7.4(GND1) U8.4(GND1) U9.4(REF) U13.3(GND) U20.4(VSS1) VD6.3(K) VD8.3(K) VD10.3(K) VD12.3(K) VD14.3(K) VD16.3(K) VD20.3(K) VD22.3(K)
GND_EPT: C6.2 C7.1 C20.2 C28.2 C40.2 D9.1(A) D10.1(A) DCT2.3(GND2) R57.2 U5.4(GND1)
OUT5V: C42.2 C45.2 C58.2 C67.2 C68.1 C72.2 R83.2 R97.1 R98.2 R105.1 U4.8(VCC) U7.8(VDD2) U8.8(VDD2) U11.16(VCC) U20.8(VDD2)
TX_24V: CN1.2(6) CN2.2(6) J3.5
TX_GND: C42.1 C45.1 C58.1 C67.1 C71.1 C72.1 CN1.1 CN1.9(5) CN2.1 CN2.9(5) D40.1(A) D41.1(A) D42.1(A) D43.1(A) J3.3 J3.6 R106.1 U4.5(GND) U7.5(GND2) U8.5(GND2) U11.15(GND) U20.5(VSS2) U21.3
VBAT: J2.28
VCC: C3.1 C4.1 C5.2 C39.2 DCT2.2(VCC) J2.21 J2.22 U5.8(VDD2) U9.6(VSP) U13.8(VIN)
VCC33: C43.2 C64.2 C66.2 J1.44 J1.46 J1.48 J2.25 J2.26 R82.2 U7.1(VDD1) U8.1(VDD1) U20.1(VDD1)
485_TEN: R83.1 U4.2(~{RE}) U4.3(DE) U21.4
7606_I0: C65.1 CT0.4 J2.14 R107.2 VD11.3(K)
7606_IA: C41.1 CTA.4 J2.12 R94.2 VD5.3(K)
7606_IB: C44.1 CTB.4 J2.11 R96.2 VD7.3(K)
7606_IC: C47.1 CTC.4 J2.13 R103.2 VD9.3(K)
7606_U0: J2.17 R12.2 R19.2
7606_UA: C74.1 J2.20 PTA.1(I) R110.2 VD13.3(K)
7606_UB: C76.1 J2.19 PTB.1(I) R114.2 VD19.3(K)
7606_UC: C75.1 J2.18 PTC.1(I) R113.2 VD15.3(K)
ADC123_IN3: J1.6  [also labelled BAT_HHT]
ADC123_IN4: J1.7
ADC123_IN8: J1.9
ADC123_IN9: J1.11
BAT_HHQ: J1.23  [also labelled SPI1_SCK]
CL_7606_I0: C104.1 J2.10 J5.14 R183.2
CL_7606_IA: C101.1 J2.7 J5.9 R180.2
CL_7606_IB: C102.1 J2.8 J5.10 R181.2
CL_7606_IC: C103.1 J2.9 J5.13 R182.2
CL_7606_U0: C100.1 J2.4 J5.6 R179.2
CL_7606_UA: C31.1 J2.1 J5.1 R43.2
CL_7606_UB: C98.1 J2.2 J5.2 R177.2
CL_7606_UC: C99.1 J2.3 J5.5 R178.2
CLCLS: J1.40
CLTRIP: J1.39
CT0: J10.7
CT0N: J10.8
CTA: J10.1
CTAN: J10.2
CTB: J10.3
CTBN: J10.4
CTC: J10.5
CTCN: J10.6
CY_CLR_OUT_FW: J1.24
CY_CLR_OUT_RW: J1.20
CY_TEST_FW: J2.31
CY_TEST_RW: J2.33
E0+: J11.9 L1.3(Sec+)
E0-: J11.10 L1.1(Pri+)
EPT0+: L1.4(Sec-) R30.2
EPT0-: L1.2(Pri-) R84.2
EPT0_Vout: R19.1 R55.2
NB1: J1.42
NB2: J1.41
NBSC: J1.37
PDA_RSTA: J2.27
PT0: J11.7 R120.1
PT0N: J11.8 PT0.3
PTA: J11.1 R117.1
PTAN: J11.2 PTA.3
PTB: J11.5 R119.1
PTBN: J11.6 PTB.3
PTC: J11.3 R118.1
PTCN: J11.4 PTC.3
PWR_STA_EXT: J1.31
PWRCLSA: J1.5
REV1: J2.30
REV2: J2.32
REV3: J2.29
RRXD3: U8.6(VOB) U11.10(ITX2)
RRXD4: U7.6(VOB) U11.11(ITX1)
RXD485: R105.2 U4.1(R) U20.7(VIA)
RXD2323: R112.1 U11.7(OTX2)
RXD2324: R109.1 U11.14(OTX1)
SPI1_MOSI: J1.32
TTXD3: U8.7(VOA) U11.9(ORX2)
TTXD4: U7.7(VOA) U11.12(ORX1)
TXD485: R97.2 U4.4(D) U20.6(VOB)
TXD2323: R111.1 U11.8(IRX2)
TXD2324: R108.1 U11.13(IRX1)
UART7_RX: J1.4 U8.2(VIA)
UART7_TX: J1.3 U8.3(VIB)
USART1_RX: J1.1 U7.2(VIA)
USART1_TX: J1.2 U7.3(VIB)
USART6_DIR: J1.21 Q9.1(B)
USART6_RX: J2.35 U20.2(VOA)
USART6_TX: J2.36 U20.3(VIB)
YKQA: J1.26
YKQB: J1.27
YKQC: J1.25
YKQD: J1.28
YKQOK: J1.30
YX1: J1.15
YX2: J1.14
YX3: J1.13
YX4: J1.8
YX_FW: J1.16
YX_HW: J1.17
YX_REV3: J1.22
YX_REV4: J2.34
YX_YDFEN: J1.19
YX_YDHE: J1.18
NetC20_1: C20.1 D9.2(K) R30.1 R54.2 R56.1
NetC40_1: C40.1 D10.2(K) R58.2 R73.1 R84.1
NetC68_2: C68.2 U11.2(V+)
NetC69_1: C69.1 U11.1(C1+)
NetC69_2: C69.2 U11.3(C1-)
NetC71_2: C71.2 U11.6(V-)
NetC73_1: C73.1 U11.5(C2-)
NetC73_2: C73.2 U11.4(C2+)
NetC77_1: C77.1 PT0.1(I) R12.1 R115.2 VD21.3(K)
NetC97_1: C97.1 U13.2(C+)
NetC97_2: C97.2 U13.4(C-)
NetCN1_3: CN1.3(2) D40.2(K) R108.2
NetCN1_5: CN1.5(3) D41.2(K) R109.2
NetCN2_3: CN2.3(2) D42.2(K) R111.2
NetCN2_5: CN2.5(3) D43.2(K) R112.2
NetD39_1: D39.1(A) J3.4 R104.1
NetD39_2: D39.2(K) J3.1 R99.1
NetPT0_2: PT0.2(O) R120.2
NetPTA_2: PTA.2(O) R117.2
NetPTB_2: PTB.2(O) R119.2
NetPTC_2: PTC.2(O) R118.2
NetQ9_3: Q9.3(C) U21.2
NetR32_2: R32.2 R55.1 U9.1(FB) U9.8(OUT)
NetR52_2: R52.2 R54.1 R57.1 R58.1
NetR56_2: R56.2 U5.2(VINP)
NetR59_1: R59.1 R64.1 U5.7(VOUTP)
NetR59_2: R59.2 R78.1 U5.6(VOUTN)
NetR64_2: R64.2 U9.2(INP)
NetR73_2: R73.2 U5.3(VINN)
NetR78_2: R78.2 U9.3(INN)
NetR82_1: R82.1 U21.1
NetR98_1: R98.1 R99.2 R100.2 U4.6(A)
NetR100_1: R100.1 R104.2 R106.2 U4.7(~{B})
NetVD5_1: VD5.1(A) VD6.1(A)
NetVD7_1: VD7.1(A) VD8.1(A)
NetVD9_1: VD9.1(A) VD10.1(A)
NetVD11_1: VD11.1(A) VD12.1(A)
NetVD13_1: VD13.1(A) VD14.1(A)
NetVD15_1: VD15.1(A) VD16.1(A)
NetVD19_1: VD19.1(A) VD20.1(A)
NetVD21_1: VD21.1(A) VD22.1(A)

Not connected (* = marked no-connect by the designer): CN1 4(7)* 6(8)* 7(4)* 8(9)* 10(NC)*; CN2 4(7) 6(8) 7(4)* 8(9) 10(NC); CT0 1 3; CTA 1 3; CTB 1 3; CTC 1 3; J1 10* 12* 29* 33* 34* 35* 36* 38*; J3 2*; U9 5(~{EN}); U13 1(NC)* 6(LV)* 7(OSC)*

### Notes on the sheet
- 连接到CPU板CT,PT信号
- 连接到CPU板
- 电池电压
- 电容电压
- 合分电流
- (near CT0) 电池电压
- ZMPT101B输入输出同名端是交叉的
- markcode:AZ

### Library data of the parts
C2-C4 C6 C97 = Cap Pol2: as C93 on sheet 12_fit_POW; Published: 8-Jun-2000; LatestRevisionDate: 17-Jul-2002; LatestRevisionNote: Re-released for DXP Platform.; PackageReference: POLAR0.8; Publisher: Altium Limited; PackageDescription: Polarized Capacitor; 2 Leads
C5 C7 C45 C58 C64 C66-C69 C71-C73 = Cap: Capacitor; Value: 100pF; Published: 8-Jun-2000; LatestRevisionDate: 17-Jul-2002; LatestRevisionNote: Re-released for DXP Platform.; PackageReference: RAD-0.3; Publisher: Altium Limited; PackageDescription: Radial Cap, Thru-Hole; 2 Leads; 0.3 in Pin Spacing
C20 C28 C31 C39-C44 C47 C65 C74-C77 C98-C104 = CAP: Capacitor
CN1 CN2 = Header 5X2: Header, 5-Pin, Dual row; LatestRevisionDate: 17-Jul-2002; LatestRevisionNote: Re-released for DXP Platform.; Publisher: Altium Limited
CT0 CTA CTB CTC = TRANS3
D9 D10 D39-D43 = TVS: Published: 8-Jun-2000; LatestRevisionDate: 17-Jul-2002; LatestRevisionNote: Re-released for DXP Platform.; PackageReference: DIODE-0.7; Publisher: Altium Limited; PackageDescription: Diode, Thru-Hole; 2 Leads; 0.7 in Pin Spacing
DCT2 = 05S05-N1/N2
J1 = Header 24X2: Header, 24-Pin, Dual row; LatestRevisionDate: 17-Jul-2002; LatestRevisionNote: Re-released for DXP Platform.; Publisher: Altium Limited
J2 = Header 18X2: Header, 18-Pin, Dual row; LatestRevisionDate: 17-Jul-2002; LatestRevisionNote: Re-released for DXP Platform.; Publisher: Altium Limited
J3 = Header 3X2: Header, 3-Pin, Dual row; LatestRevisionDate: 17-Jul-2002; LatestRevisionNote: Re-released for DXP Platform.; Publisher: Altium Limited
J5 = Header 8X2: Header, 8-Pin, Dual row; LatestRevisionDate: 17-Jul-2002; LatestRevisionNote: Re-released for DXP Platform.; Publisher: Altium Limited
J10 = Header 8: Header, 8-Pin; LatestRevisionDate: 17-Jul-2002; LatestRevisionNote: Re-released for DXP Platform.; Publisher: Altium Limited
J11 = Header 10: Header, 10-Pin; LatestRevisionDate: 17-Jul-2002; LatestRevisionNote: Re-released for DXP Platform.; Publisher: Altium Limited
L1 = Trans Cupl: Transformer (Coupled Inductor Model); Published: 8-Jun-2000; LatestRevisionDate: 17-Jul-2002; LatestRevisionNote: Re-released for DXP Platform.; PackageReference: TRF_4; Publisher: Altium Limited; PackageDescription: Transformer; 4 Leads
PT0 PTA PTB PTC = V-SENOR
Q9 = SOT-23 2SC3356-T1B-A    S/YS档: 三极管; ComponentLink1Description: 供应商链接; ComponentLink1URL: http://www.szlcsc.com/product/details_10189.html; Package: SOT-23; Supplier: LC; SuppliersPartNumber: C9659
R12 R19 R30 R32 R52 R55-R57 R59 R64 R73 R78 R84 R97-R100 R104-R106 = Res1: Resistor; Value: 10K; Published: 8-Jun-2000; LatestRevisionDate: 17-Jul-2002; LatestRevisionNote: Re-released for DXP Platform.; PackageReference: AXIAL-0.3; Publisher: Altium Limited; PackageDescription: Axial Device, Thru-Hole; 2 Leads; 0.3 in Pin Spacing
R43 R82 R83 R94 R96 R103 R107 R110 R113-R115 R117-R120 R177-R183 = RES2
R54 R58 = Res1: Resistor; Published: 8-Jun-2000; LatestRevisionDate: 17-Jul-2002; LatestRevisionNote: Re-released for DXP Platform.; PackageReference: AXIAL-0.3; Publisher: Altium Limited; PackageDescription: Axial Device, Thru-Hole; 2 Leads; 0.3 in Pin Spacing; Value: 10K
R108 R109 R111 R112 = RES
U4 = SN75176AD: Differential Bus Transceiver; Note: Receiver Hysteresis of 50mV Typical; Published: 15-May-2002; LatestRevisionDate: 13-Apr-2006; LatestRevisionNote: IPC-7351 Footprint Added.; DatasheetVersion: Aug-1989; PackageVersion: Jan-1998; PackageReference: D008; Publisher: Altium Limited; PackageDescription: 8-Pin Small Outline Integrated Circuit 1.27 mm Pitch; Code_IPC: SOIC127P600-8; ComponentLink1Description: Manufacturer Link; ComponentLink1URL: http://www.ti.com/; ComponentLink2Description: Datasheet; ComponentLink2URL: http://www-s.ti.com/sc/ds/sn75176a.pdf
U5 = AMC1200SDUBR: single power isolator amp fixed gain is 8
U7 U8 = ADUM1201ARZ-RL7: 隔离器; ComponentLink1Description: 供应商链接; ComponentLink1URL: http://www.szlcsc.com/product/details_10199.html; Package: SOIC-8_150mil; Supplier: LC; SuppliersPartNumber: C9669
U11 = MAX202
U13 = TC7660EOA: Charge Pump DC-to-DC Voltage Converter, 8-Pin SOIC 150mil, Industrial Temperature; Published: 29-Jan-2009; DatasheetVersion: revB, Nov-2002; PackageVersion: revAW, Oct-2008; PackageReference: SOIC-OA8; Publisher: Altium Limited; PackageDescription: 8-Lead Plastic Small Outline (OA) - Narrow, 3.90mm Body [SOIC]; Code_IPC: SOIC127P600-8; ComponentLink1Description: Manufacturer Link; ComponentLink1URL: http://www.microchip.com; ComponentLink2Description: Datasheet; ComponentLink2URL: http://ww1.microchip.com/downloads/en/DeviceDoc/21465b.pdf; ComponentLink3Description: Packaging Specification; ComponentLink3URL: http://ww1.microchip.com/downloads/en/PackagingSpec/00049AW.pdf
U20 = COMPONENT_3
U21 = TLP521
VD5-VD16 VD19-VD22 = ZENER2

## Sheet 12_fit_YX.SchDoc
size B; SheetNumber: 1; SheetTotal: 3
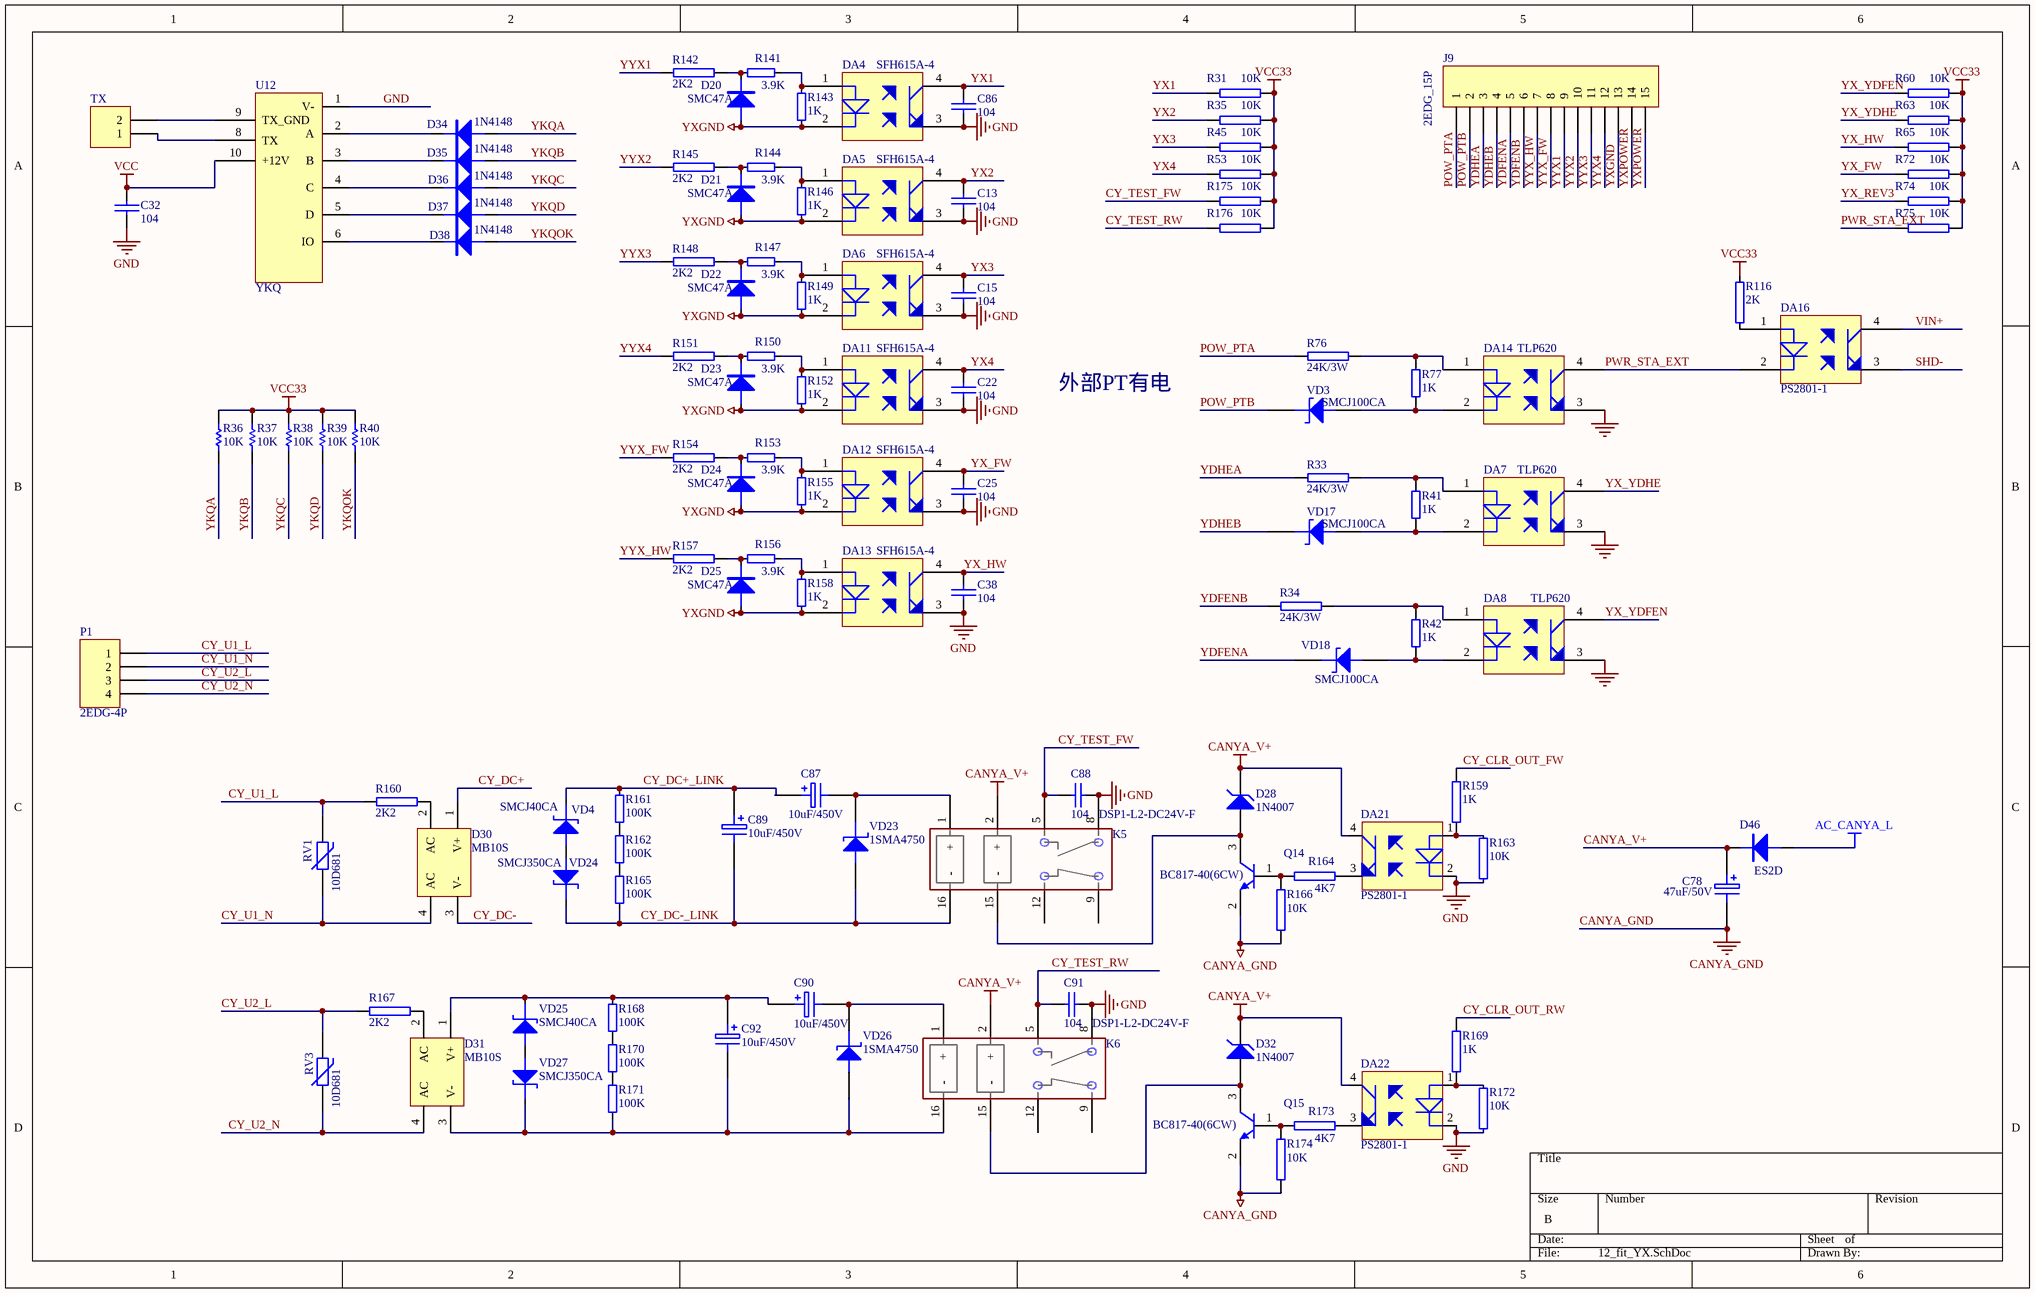
[diagram p4: 12_fit_YX.SchDoc]

### Parts
C13  104  [C1206]
C15  104  [C1206]
C22  104  [C1206]
C25  104  [C1206]
C32  104  [C1206]
C38  104  [C1206]
C78  47uF/50V  [47u/50V]
C86  104  [C1206]
C87  10uF/450V  [10u/450V]
C88  104  [C1206]
C89  10uF/450V  [10u/450V]
C90  10uF/450V  [10u/450V]
C91  104  [C1206]
C92  10uF/450V  [10u/450V]
D20  SMC47A  [DO-214AB]
D21  SMC47A  [DO-214AB]
D22  SMC47A  [DO-214AB]
D23  SMC47A  [DO-214AB]
D24  SMC47A  [DO-214AB]
D25  SMC47A  [DO-214AB]
D28  1N4007  [DO-214AC]
D30  MB10S  [TO-269AA]
D31  MB10S  [TO-269AA]
D32  1N4007  [DO-214AC]
D34  1N4148  [SMT_4148]
D35  1N4148  [SMT_4148]
D36  1N4148  [SMT_4148]
D37  1N4148  [SMT_4148]
D38  1N4148  [SMT_4148]
D46  ES2D  [DO-214AA]
DA4  SFH615A-4  [SFH615A-4]
DA5  SFH615A-4  [SFH615A-4]
DA6  SFH615A-4  [SFH615A-4]
DA7  TLP620  [dip4]
DA8  TLP620  [dip4]
DA11  SFH615A-4  [SFH615A-4]
DA12  SFH615A-4  [SFH615A-4]
DA13  SFH615A-4  [SFH615A-4]
DA14  TLP620  [dip4]
DA16  PS2801-1  [SO-4]
DA21  PS2801-1  [SO-4]
DA22  PS2801-1  [SO-4]
J9  2EDG_15P  [XR_POWER5.08_15_弯]
K5  DSP1-L2-DC24V-F  [DSP1-L2-DC24V-F]
K6  DSP1-L2-DC24V-F  [DSP1-L2-DC24V-F]
P1  2EDG-4P  [XR_POWER5.08_4_弯]
Q14  BC817-40(6CW)  [SOT-23]
Q15  BC817-40(6CW)  [SOT-23]
R31  10K  [R1206]
R33  24K/3W  [res-l5]
R34  24K/3W  [res-l5]
R35  10K  [R1206]
R36  10K  [R1206]
R37  10K  [R1206]
R38  10K  [R1206]
R39  10K  [R1206]
R40  10K  [R1206]
R41  1K  [R1206]
R42  1K  [R1206]
R45  10K  [R1206]
R53  10K  [R1206]
R60  10K  [R1206]
R63  10K  [R1206]
R65  10K  [R1206]
R72  10K  [R1206]
R74  10K  [R1206]
R75  10K  [R1206]
R76  24K/3W  [res-l5]
R77  1K  [R1206]
R116  2K  [R1206]
R141  3.9K  [R1206]
R142  2K2  [res_0.5W-L-5.08]
R143  1K  [R1206]
R144  3.9K  [R1206]
R145  2K2  [res_0.5W-L-5.08]
R146  1K  [R1206]
R147  3.9K  [R1206]
R148  2K2  [res_0.5W-L-5.08]
R149  1K  [R1206]
R150  3.9K  [R1206]
R151  2K2  [res_0.5W-L-5.08]
R152  1K  [R1206]
R153  3.9K  [R1206]
R154  2K2  [res_0.5W-L-5.08]
R155  1K  [R1206]
R156  3.9K  [R1206]
R157  2K2  [res_0.5W-L-5.08]
R158  1K  [R1206]
R159  1K  [R1206]
R160  2K2  [res_0.5W-L-5.08]
R161  100K  [R1206]
R162  100K  [R1206]
R163  10K  [R1206]
R164  4K7  [R1206]
R165  100K  [R1206]
R166  10K  [R1206]
R167  2K2  [res_0.5W-L-5.08]
R168  100K  [R1206]
R169  1K  [R1206]
R170  100K  [R1206]
R171  100K  [R1206]
R172  10K  [R1206]
R173  4K7  [R1206]
R174  10K  [R1206]
R175  10K  [R1206]
R176  10K  [R1206]
RV1  10D681  [NTC]
RV3  10D681  [NTC]
TX  (no value)  [XH_2.54*2]
U12  YKQ  [YKQ]
VD3  SMCJ100CA  [DO-214AB]
VD4  SMCJ40CA  [DO-214AB]
VD17  SMCJ100CA  [DO-214AB]
VD18  SMCJ100CA  [DO-214AB]
VD23  1SMA4750  [DO-214AC]
VD24  SMCJ350CA  [DO-214AB]
VD25  SMCJ40CA  [DO-214AB]
VD26  1SMA4750  [DO-214AC]
VD27  SMCJ350CA  [DO-214AB]

### Nets
AC_CANYA_L: D46.1(A)
CANYA_GND: C78.2 Q14.2(E) Q15.2(E) R166.1 R174.1
CANYA_V+: C78.1 D28.2(K) D32.2(K) D46.2(K) DA21.4 DA22.4 K5.2(+) K6.2(+)
GND: C13.1 C15.1 C22.1 C25.1 C32.1 C38.1 C86.1 C88.1 C91.1 DA4.3 DA5.3 DA6.3 DA7.3 DA8.3 DA11.3 DA12.3 DA13.3 DA14.3 DA21.2 DA22.2 K5.8(NO_COM) K6.8(NO_COM) R163.1 R172.1 U12.1(V-)
VCC: C32.2 U12.10(+12V)
VCC33: R31.2 R35.2 R36.1 R37.2 R38.2 R39.2 R40.2 R45.2 R53.2 R60.2 R63.2 R65.2 R72.2 R74.2 R75.2 R116.1 R175.2 R176.2
YXGND: D20.1(A) D21.1(A) D22.1(A) D23.1(A) D24.1(A) D25.1(A) DA4.2 DA5.2 DA6.2 DA11.2 DA12.2 DA13.2 J9.13 R143.2 R146.2 R149.2 R152.2 R155.2 R158.2
YXPOWER: J9.14 J9.15  [project net +FV_YX]
CY_CLR_OUT_FW: R159.2
CY_CLR_OUT_RW: R169.2
CY_DC+: D30.1(V+)
CY_DC+_LINK: C87.1 C89.1 R161.2 VD4.2(K)
CY_DC-: D30.3(V-)
CY_DC-_LINK: C89.2 K5.16(-) R165.1 VD23.1(A) VD24.2(K)
CY_TEST_FW: C88.2 K5.5(NO) R175.1
CY_TEST_RW: C91.2 K6.5(NO) R176.1
CY_U1_L: P1.1 R160.1 RV1.2
CY_U1_N: D30.4(AC) P1.2 RV1.1
CY_U2_L: P1.3 R167.1 RV3.2
CY_U2_N: D31.4(AC) P1.4 RV3.1
POW_PTA: J9.1 R76.1
POW_PTB: J9.2 VD3.2(K)
PWR_STA_EXT: DA14.4 DA16.2 R75.1
SHD-: DA16.3
VIN+: DA16.4
YDFENA: J9.5 VD18.2(K)
YDFENB: J9.6 R34.1
YDHEA: J9.3 R33.1
YDHEB: J9.4 VD17.2(K)
YKQA: D34.1(A) R36.2
YKQB: D35.1(A) R37.1
YKQC: D36.1(A) R38.1
YKQD: D37.1(A) R39.1
YKQOK: D38.1(A) R40.1
YX1: C86.2 DA4.4 R31.1
YX2: C13.2 DA5.4 R35.1
YX3: C15.2 DA6.4 R45.1
YX4: C22.2 DA11.4 R53.1
YX_FW: C25.2 DA12.4 R72.1
YX_HW: C38.2 DA13.4 R65.1
YX_REV3: R74.1
YX_YDFEN: DA8.4 R60.1
YX_YDHE: DA7.4 R63.1
YYX1: J9.9 R142.1
YYX2: J9.10 R145.1
YYX3: J9.11 R148.1
YYX4: J9.12 R151.1
YYX_FW: J9.8 R154.1
YYX_HW: J9.7 R157.1
NetC87_2: C87.2 K5.1(+) VD23.2(K)
NetC90_1: C90.1 C92.1 D31.1(V+) R168.2 VD25.2(K)
NetC90_2: C90.2 K6.1(+) VD26.2(K)
NetC92_2: C92.2 D31.3(V-) K6.16(-) R171.1 VD26.1(A) VD27.2(K)
NetD20_2: D20.2(K) R141.1 R142.2
NetD21_2: D21.2(K) R144.1 R145.2
NetD22_2: D22.2(K) R147.1 R148.2
NetD23_2: D23.2(K) R150.1 R151.2
NetD24_2: D24.2(K) R153.1 R154.2
NetD25_2: D25.2(K) R156.1 R157.2
NetD28_1: D28.1(A) K5.15(-) Q14.3(C)
NetD30_2: D30.2(AC) R160.2
NetD31_2: D31.2(AC) R167.2
NetD32_1: D32.1(A) K6.15(-) Q15.3(C)
NetD34_2: D34.2(K) U12.2(A)
NetD35_2: D35.2(K) U12.3(B)
NetD36_2: D36.2(K) U12.4(C)
NetD37_2: D37.2(K) U12.5(D)
NetD38_2: D38.2(K) U12.6(IO)
NetDA4_1: DA4.1 R141.2 R143.1
NetDA5_1: DA5.1 R144.2 R146.1
NetDA6_1: DA6.1 R147.2 R149.1
NetDA7_1: DA7.1 R33.2 R41.1
NetDA7_2: DA7.2 R41.2 VD17.1(A)
NetDA8_1: DA8.1 R34.2 R42.2
NetDA8_2: DA8.2 R42.1 VD18.1(A)
NetDA11_1: DA11.1 R150.2 R152.1
NetDA12_1: DA12.1 R153.2 R155.1
NetDA13_1: DA13.1 R156.2 R158.1
NetDA14_1: DA14.1 R76.2 R77.1
NetDA14_2: DA14.2 R77.2 VD3.1(A)
NetDA16_1: DA16.1 R116.2
NetDA21_1: DA21.1 R159.1 R163.2
NetDA21_3: DA21.3 R164.1
NetDA22_1: DA22.1 R169.1 R172.2
NetDA22_3: DA22.3 R173.1
NetQ14_1: Q14.1(B) R164.2 R166.2
NetQ15_1: Q15.1(B) R173.2 R174.2
NetR161_1: R161.1 R162.2
NetR162_1: R162.1 R165.2
NetR168_1: R168.1 R170.2
NetR170_1: R170.1 R171.2
NetTX_1: TX.1 U12.8(TX)
NetTX_2: TX.2 U12.9(TX_GND)
NetVD4_1: VD4.1(A) VD24.1(A)
NetVD25_1: VD25.1(A) VD27.1(A)

Not connected (* = marked no-connect by the designer): K5 9(NC_COM) 12(NC); K6 9(NC_COM) 12(NC)

### Notes on the sheet
- 外部PT有电

### Library data of the parts
C13 C15 C22 C25 C32 C38 C86 C88 C91 = CAP
C78 C87 C89 C90 C92 = ELECTRO1: Electrolytic Capacitor
D20-D25 D34-D38 D46 = DIODE
D28 D32 = D Zener: Zener Diode; Published: 8-Jun-2000; LatestRevisionDate: 17-Jul-2002; LatestRevisionNote: Re-released for DXP Platform.; PackageReference: DIODE-0.7; Publisher: Altium Limited; PackageDescription: Diode, Thru-Hole; 2 Leads; 0.7 in Pin Spacing
D30 D31 = Bridge2: Diode Bridge; Published: 24-Mar-1999; LatestRevisionDate: 17-Jul-2002; LatestRevisionNote: Re-released for DXP Platform.; PackageReference: D-46_6A; Publisher: Altium Limited; PackageDescription: Bridge Rectifier; 4 Terminals; Body 16.8 x 16.8 mm (typ); Pitch 10.67 mm
DA4-DA8 DA11-DA14 DA16 DA21 DA22 = TLP521-1
J9 = Header 15: Header, 15-Pin; LatestRevisionDate: 17-Jul-2002; LatestRevisionNote: Re-released for DXP Platform.; Publisher: Altium Limited
P1 = Header 4: Header, 4-Pin; LatestRevisionDate: 17-Jul-2002; LatestRevisionNote: Re-released for DXP Platform.; Publisher: Altium Limited
Q14 Q15 = SOT-23 2SC3356-T1B-A    S/YS档: NPN; ComponentLink1Description: 供应商链接; ComponentLink1URL: http://www.szlcsc.com/product/details_10189.html; Package: SOT-23; Supplier: LC; SuppliersPartNumber: C9659
R31 R33-R35 R45 R53 R60 R63 R65 R72 R74-R76 R116 R142 R145 R148 R151 R154 R157 R159 R160 R163 R164 R166 R167 R169 R172-R176 = RES2
R36-R40 = Res1: Resistor; Published: 8-Jun-2000; LatestRevisionDate: 17-Jul-2002; LatestRevisionNote: Re-released for DXP Platform.; PackageReference: AXIAL-0.3; Publisher: Altium Limited; PackageDescription: Axial Device, Thru-Hole; 2 Leads; 0.3 in Pin Spacing; Value: 10K
R41 R42 R77 R141 R143 R144 R146 R147 R149 R150 R152 R153 R155 R156 R158 R161 R162 R165 R168 R170 R171 = RES
RV1 RV3 = VARISTOR
TX = Header 2: Header, 2-Pin; LatestRevisionDate: 17-Jul-2002; LatestRevisionNote: Re-released for DXP Platform.; Publisher: Altium Limited
U12 = ZENER3_1: Zener Diode
VD3 VD17 = ZENER2: 双向TVS
VD4 VD18 VD23-VD27 = ZENER2: Zener Diode

## Nets that join several sheets
12GND: 12_fit_YK (11 pins), 12_fit_POW (13 pins)
12V: 12_fit_YK (9 pins), 12_fit_POW (C8.1 C14.1 C34.1 D14.2)
+FV_YX: 12_fit_YK (7 pins), 12_fit_YX (J9.14 J9.15)
GND: 12_fit_POW (24 pins), 12_fit_YC (82 pins), 12_fit_YX (25 pins)
LOAD: 12_fit_YK (D7.1), 12_fit_POW (9 pins)
OUT5V: 12_fit_POW (5 pins), 12_fit_YC (15 pins)
PGND: 12_fit_YK (11 pins), 12_fit_POW (40 pins)
TX_24V: 12_fit_POW (5 pins), 12_fit_YC (CN1.2 CN2.2 J3.5)
TX_GND: 12_fit_POW (10 pins), 12_fit_YC (23 pins)
VBAT: 12_fit_POW (BT1.1), 12_fit_YC (J2.28)
VCC: 12_fit_POW (7 pins), 12_fit_YC (10 pins), 12_fit_YX (C32.2 U12.10)
VCC33: 12_fit_POW (12 pins), 12_fit_YC (12 pins), 12_fit_YX (18 pins)
YXGND: 12_fit_YK (6 pins), 12_fit_YX (19 pins)
ADC123_IN3: 12_fit_POW (Q10.1), 12_fit_YC (J1.6)
ADC123_IN4: 12_fit_POW (U17.6 U17.7), 12_fit_YC (J1.7)
ADC123_IN8: 12_fit_YK (P3.8), 12_fit_YC (J1.9)
ADC123_IN9: 12_fit_YK (P3.7), 12_fit_YC (J1.11)
BAT_HHQ: 12_fit_POW (D1.1), 12_fit_YC (J1.23)
CLCLS: 12_fit_YK (P3.3 P3.4 R95.1), 12_fit_YC (J1.40)
CLTRIP: 12_fit_YK (P3.5 P3.6 R85.1), 12_fit_YC (J1.39)
CY_CLR_OUT_FW: 12_fit_YC (J1.24), 12_fit_YX (R159.2)
CY_CLR_OUT_RW: 12_fit_YC (J1.20), 12_fit_YX (R169.2)
CY_TEST_FW: 12_fit_YC (J2.31), 12_fit_YX (C88.2 K5.5 R175.1)
CY_TEST_RW: 12_fit_YC (J2.33), 12_fit_YX (C91.2 K6.5 R176.1)
NB1: 12_fit_YK (R137.1), 12_fit_YC (J1.42)
NBSC: 12_fit_YK (R93.1), 12_fit_YC (J1.37)
PWR_STA_EXT: 12_fit_YC (J1.31), 12_fit_YX (DA14.4 DA16.2 R75.1)
PWRCLSA: 12_fit_POW (Q4.1), 12_fit_YC (J1.5)
SHD-: 12_fit_POW (D4.1 DA3.3 R9.2), 12_fit_YX (DA16.3)
VIN+: 12_fit_POW (6 pins), 12_fit_YX (DA16.4)
YKQA: 12_fit_YC (J1.26), 12_fit_YX (D34.1 R36.2)
YKQB: 12_fit_YC (J1.27), 12_fit_YX (D35.1 R37.1)
YKQC: 12_fit_YC (J1.25), 12_fit_YX (D36.1 R38.1)
YKQD: 12_fit_YC (J1.28), 12_fit_YX (D37.1 R39.1)
YKQOK: 12_fit_YC (J1.30), 12_fit_YX (D38.1 R40.1)
YX1: 12_fit_YC (J1.15), 12_fit_YX (C86.2 DA4.4 R31.1)
YX2: 12_fit_YC (J1.14), 12_fit_YX (C13.2 DA5.4 R35.1)
YX3: 12_fit_YC (J1.13), 12_fit_YX (C15.2 DA6.4 R45.1)
YX4: 12_fit_YC (J1.8), 12_fit_YX (C22.2 DA11.4 R53.1)
YX_FW: 12_fit_YC (J1.16), 12_fit_YX (C25.2 DA12.4 R72.1)
YX_HW: 12_fit_YC (J1.17), 12_fit_YX (C38.2 DA13.4 R65.1)
YX_REV3: 12_fit_YC (J1.22), 12_fit_YX (R74.1)
YX_YDFEN: 12_fit_YC (J1.19), 12_fit_YX (DA8.4 R60.1)
YX_YDHE: 12_fit_YC (J1.18), 12_fit_YX (DA7.4 R63.1)